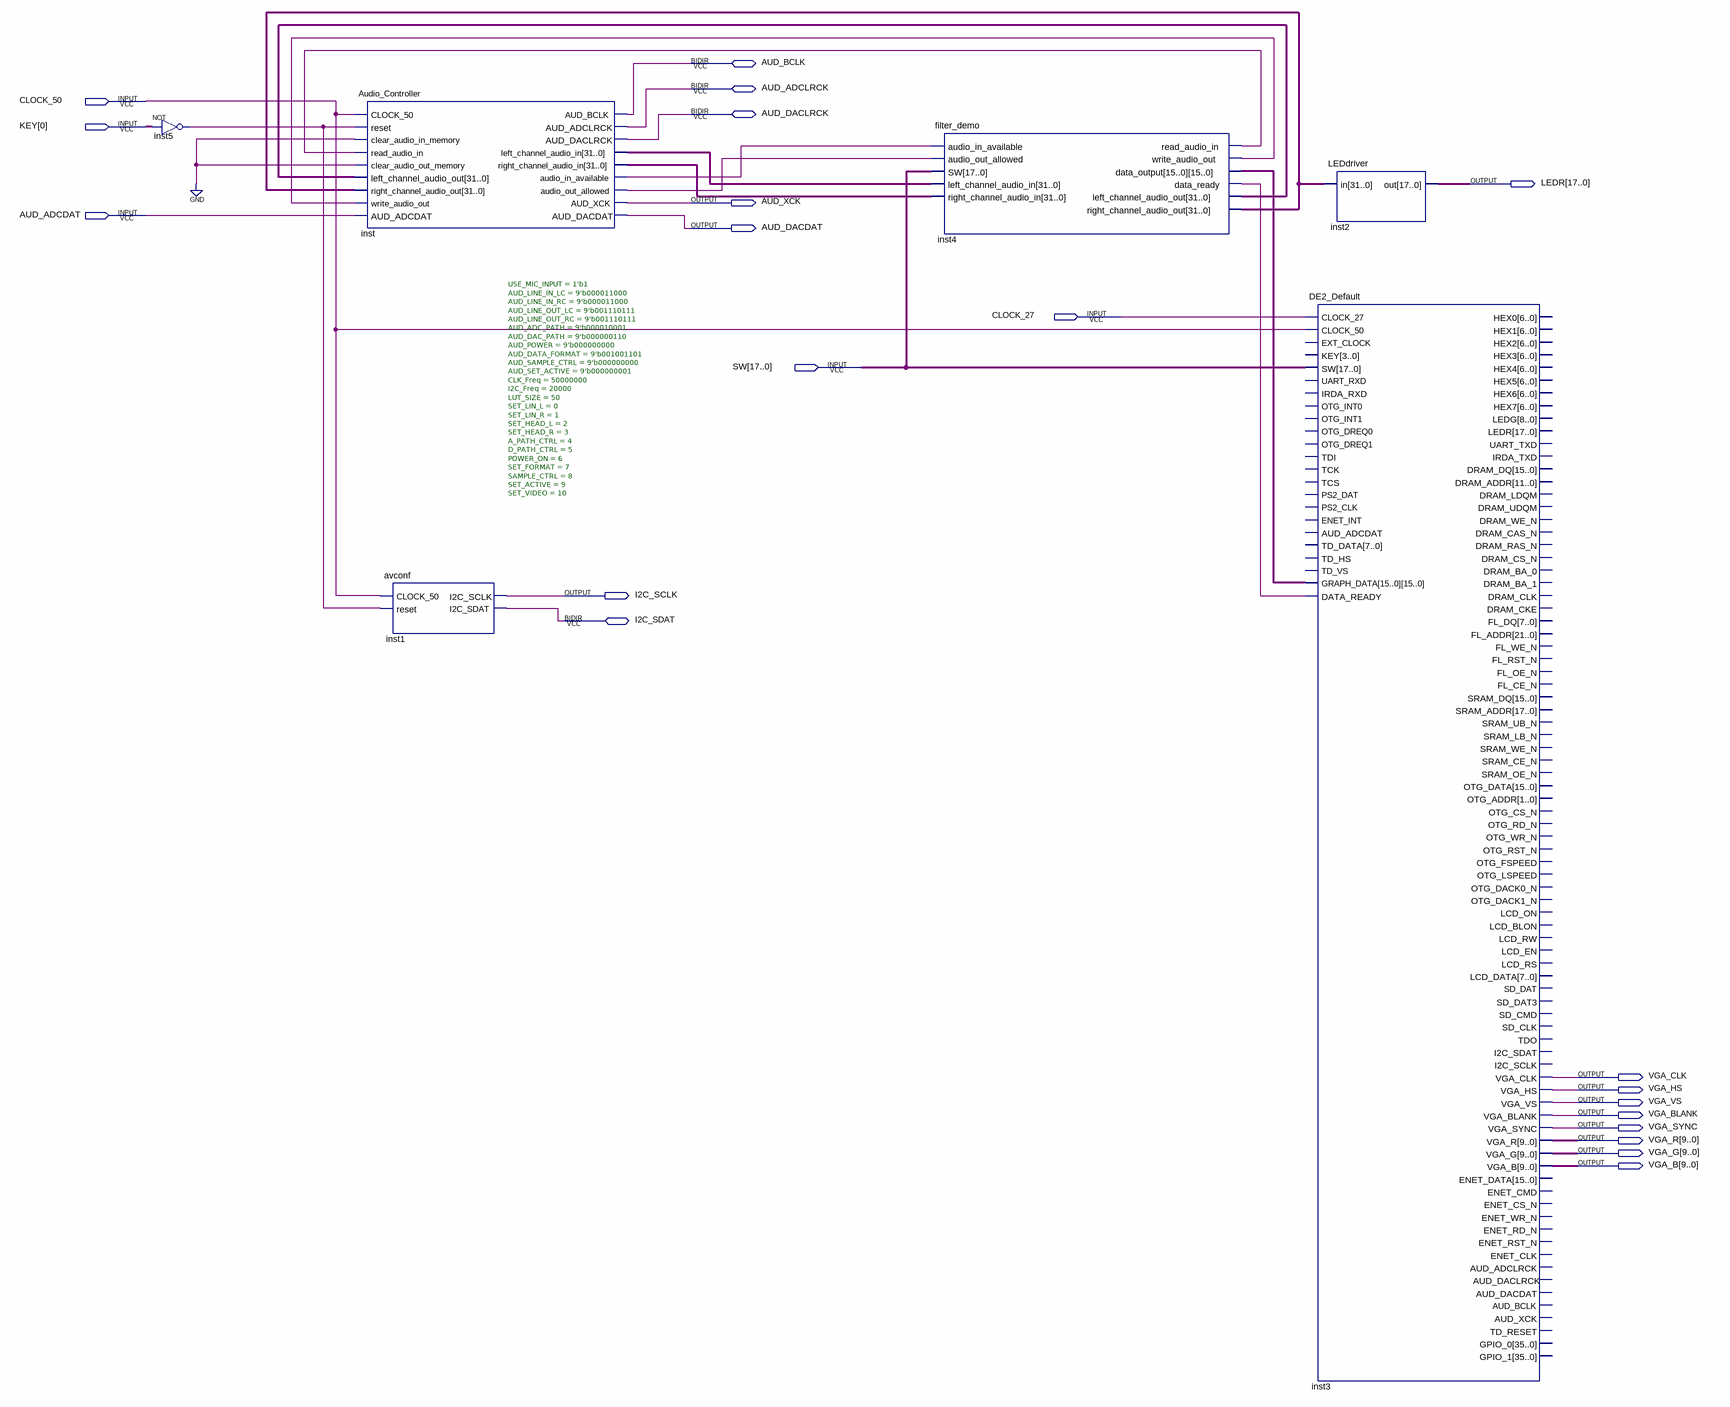
[diagram p0: schematic sheet]
// Quartus schematic toplevel.bdf as structural Verilog: 6 symbols, 21 pins
module toplevel (
  input  CLOCK_50,
  input  [0:0] KEY,
  input  AUD_ADCDAT,
  input  CLOCK_27,
  input  [17:0] SW,
  inout  AUD_BCLK,
  inout  AUD_ADCLRCK,
  inout  AUD_DACLRCK,
  inout  I2C_SDAT,
  output [17:0] LEDR,
  output AUD_XCK,
  output AUD_DACDAT,
  output I2C_SCLK,
  output VGA_CLK,
  output VGA_HS,
  output VGA_VS,
  output VGA_BLANK,
  output VGA_SYNC,
  output [9:0] VGA_R,
  output [9:0] VGA_G,
  output [9:0] VGA_B
);

  wire inst4_data_ready, inst4_read_audio_in, inst4_write_audio_out, inst5_out, inst_audio_in_available,
       inst_audio_out_allowed;
  wire [31:0] inst4_left_channel_audio_out, inst4_right_channel_audio_out, inst_left_channel_audio_in,
       inst_right_channel_audio_in;
  wire [255:0] inst4_data_output;

  not inst5 (inst5_out, KEY[0]);
  Audio_Controller inst (
    .CLOCK_50(CLOCK_50), .reset(inst5_out), .clear_audio_in_memory(1'b0),
    .read_audio_in(inst4_read_audio_in), .clear_audio_out_memory(1'b0),
    .left_channel_audio_out(inst4_left_channel_audio_out),
    .right_channel_audio_out(inst4_right_channel_audio_out), .write_audio_out(inst4_write_audio_out),
    .AUD_ADCDAT(AUD_ADCDAT), .left_channel_audio_in(inst_left_channel_audio_in),
    .right_channel_audio_in(inst_right_channel_audio_in), .audio_in_available(inst_audio_in_available),
    .audio_out_allowed(inst_audio_out_allowed), .AUD_XCK(AUD_XCK), .AUD_DACDAT(AUD_DACDAT),
    .AUD_BCLK(AUD_BCLK), .AUD_ADCLRCK(AUD_ADCLRCK), .AUD_DACLRCK(AUD_DACLRCK));
  avconf #(.USE_MIC_INPUT(1'b1), .AUD_LINE_IN_LC(9'b000011000), .AUD_LINE_IN_RC(9'b000011000), .AUD_LINE_OUT_LC(9'b001110111), .AUD_LINE_OUT_RC(9'b001110111), .AUD_ADC_PATH(9'b000010001), .AUD_DAC_PATH(9'b000000110), .AUD_POWER(9'b000000000), .AUD_DATA_FORMAT(9'b001001101), .AUD_SAMPLE_CTRL(9'b000000000), .AUD_SET_ACTIVE(9'b000000001), .CLK_Freq(50000000), .I2C_Freq(20000), .LUT_SIZE(50), .SET_LIN_L(0), .SET_LIN_R(1), .SET_HEAD_L(2), .SET_HEAD_R(3), .A_PATH_CTRL(4), .D_PATH_CTRL(5), .POWER_ON(6), .SET_FORMAT(7), .SAMPLE_CTRL(8), .SET_ACTIVE(9), .SET_VIDEO(10)) inst1 (
    .CLOCK_50(CLOCK_50), .reset(inst5_out), .I2C_SCLK(I2C_SCLK), .I2C_SDAT(I2C_SDAT));
  filter_demo inst4 (
    .audio_in_available(inst_audio_in_available), .audio_out_allowed(inst_audio_out_allowed), .SW(SW),
    .left_channel_audio_in(inst_left_channel_audio_in), .right_channel_audio_in(inst_right_channel_audio_in),
    .read_audio_in(inst4_read_audio_in), .write_audio_out(inst4_write_audio_out),
    .data_output(inst4_data_output), .data_ready(inst4_data_ready),
    .left_channel_audio_out(inst4_left_channel_audio_out),
    .right_channel_audio_out(inst4_right_channel_audio_out));
  DE2_Default inst3 (
    .CLOCK_27(CLOCK_27), .CLOCK_50(CLOCK_50), .SW(SW), .GRAPH_DATA(inst4_data_output),
    .DATA_READY(inst4_data_ready), .VGA_CLK(VGA_CLK), .VGA_HS(VGA_HS), .VGA_VS(VGA_VS),
    .VGA_BLANK(VGA_BLANK), .VGA_SYNC(VGA_SYNC), .VGA_R(VGA_R), .VGA_G(VGA_G), .VGA_B(VGA_B));  // open: EXT_CLOCK, KEY, UART_RXD, IRDA_RXD, OTG_INT0, OTG_INT1, OTG_DREQ0, OTG_DREQ1, TDI, TCK, TCS, PS2_DAT, PS2_CLK, ENET_INT, AUD_ADCDAT, TD_DATA, TD_HS, TD_VS, HEX0, HEX1, HEX2, HEX3, HEX4, HEX5, HEX6, HEX7, LEDG, LEDR, UART_TXD, IRDA_TXD, DRAM_ADDR, DRAM_LDQM, DRAM_UDQM, DRAM_WE_N, DRAM_CAS_N, DRAM_RAS_N, DRAM_CS_N, DRAM_BA_0, DRAM_BA_1, DRAM_CLK, DRAM_CKE, FL_ADDR, FL_WE_N, FL_RST_N, FL_OE_N, FL_CE_N, SRAM_ADDR, SRAM_UB_N, SRAM_LB_N, SRAM_WE_N, SRAM_CE_N, SRAM_OE_N, OTG_ADDR, OTG_CS_N, OTG_RD_N, OTG_WR_N, OTG_RST_N, OTG_FSPEED, OTG_LSPEED, OTG_DACK0_N, OTG_DACK1_N, LCD_ON, LCD_BLON, LCD_RW, LCD_EN, LCD_RS, SD_CLK, TDO, I2C_SCLK, ENET_CMD, ENET_CS_N, ENET_WR_N, ENET_RD_N, ENET_RST_N, ENET_CLK, AUD_ADCLRCK, AUD_DACDAT, AUD_XCK, TD_RESET, DRAM_DQ, FL_DQ, SRAM_DQ, OTG_DATA, LCD_DATA, SD_DAT, SD_DAT3, SD_CMD, I2C_SDAT, ENET_DATA, AUD_DACLRCK, AUD_BCLK, GPIO_0, GPIO_1
  LEDdriver inst2 (.in(inst4_right_channel_audio_out), .out(LEDR));
endmodule
